# EAGLE design adum (EAGLE 7.2.0)
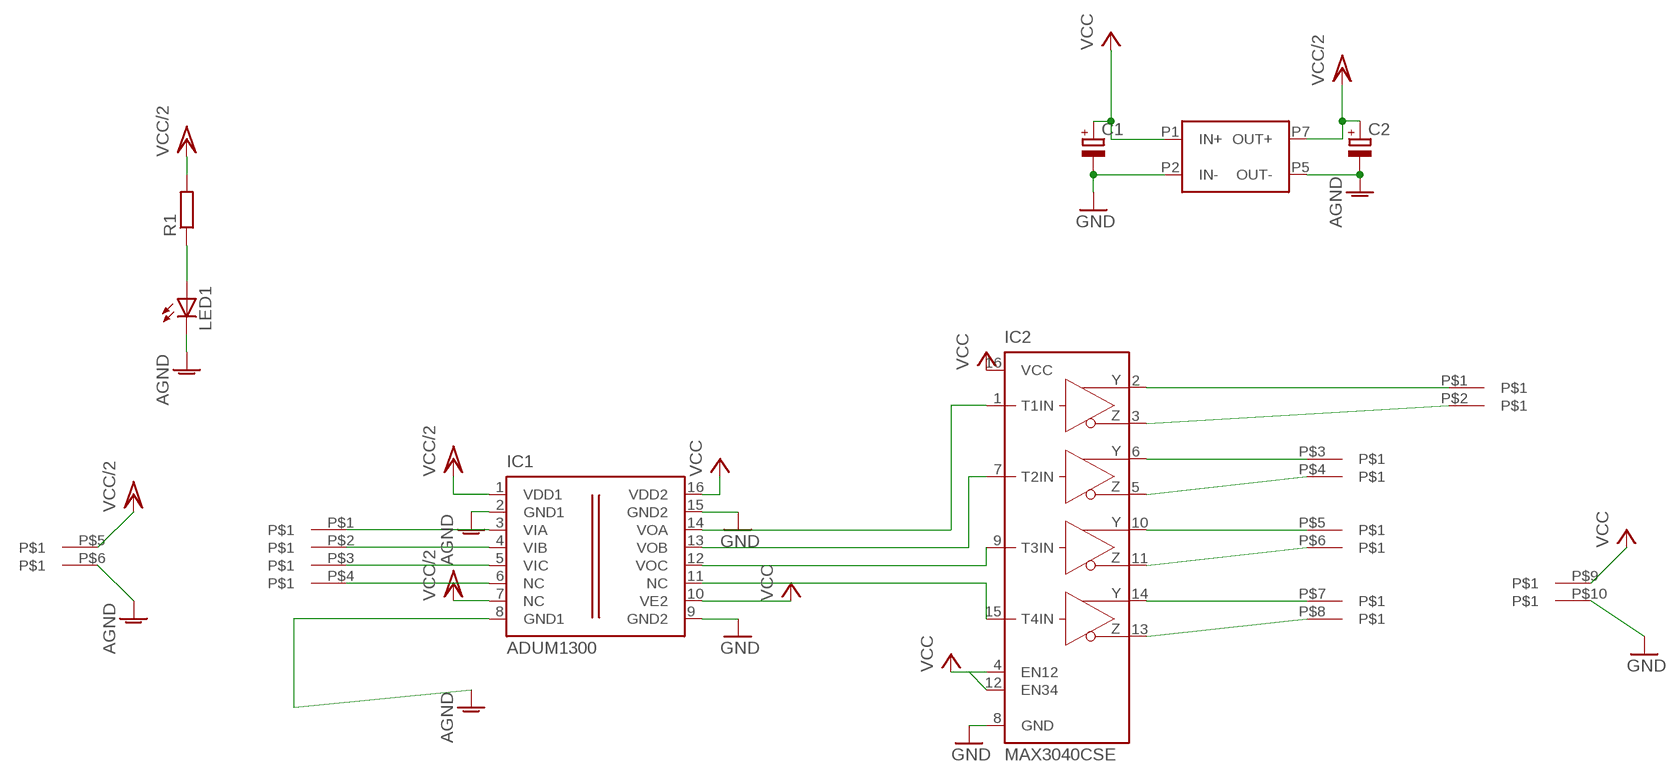
[diagram p0: schematic, sheet 1]

## Parts
C1  CPOL-EUSMCD  [SMC_D]
C2  CPOL-EUSMCD  [SMC_D]
IC1  ADUM1300  [SO-16W]
IC2  MAX3040CSE  [SO16]
LED1  LEDCHIP-LED0805  [CHIP-LED0805]
R1  R-EU_M0805  [M0805]
U$1  2X5  [2X5]
U$2  2X3  [2X3]
U$3  DCDC  [PWR]

## Nets
AGND: C2.- IC1.2(GND1) IC1.8(GND1) LED1.C U$2.P$6 U$3.P5(OUT-)
GND: C1.- IC1.9(GND2) IC1.15(GND2) IC2.8(GND) U$1.P$10 U$3.P2(IN-)
N$1: IC1.14(VOA) IC2.1(T1IN)
N$2: IC1.13(VOB) IC2.7(T2IN)
N$3: IC1.12(VOC) IC2.9(T3IN)
N$4: IC1.11(NC) IC2.15(T4IN)
N$5: IC2.3(Z1) U$1.P$2
N$6: IC2.2(Y1) U$1.P$1
N$7: IC2.11(Z3) U$1.P$6
N$8: IC1.6(NC) U$2.P$4
N$9: IC1.5(VIC) U$2.P$3
N$10: IC2.10(Y3) U$1.P$5
N$11: IC1.4(VIB) U$2.P$2
N$12: IC2.14(Y4) U$1.P$7
N$14: IC2.6(Y2) U$1.P$3
N$15: IC1.3(VIA) U$2.P$1
N$16: IC2.5(Z2) U$1.P$4
N$17: LED1.A R1.1
N$21: IC2.13(Z4) U$1.P$8
VCC: C1.+ IC1.10(VE2) IC1.16(VDD2) IC2.4(EN12) IC2.12(EN34) IC2.16(VCC) U$1.P$9 U$3.P1(IN+)
VCC/2: C2.+ IC1.1(VDD1) IC1.7(NC) R1.2 U$2.P$5 U$3.P7(OUT+)

## Library data of the parts
C1 C2 = resistor:CPOL-EU: POLARIZED CAPACITOR, European symbol
IC1 = analog-devices:ADUM1300: Triple-Channel Digital Isolators Source: http://www.analog.com/static/imported-files/data_sheets/ADuM1300_1301.pdf; MPN: ADUM1300ARWZ; OC_FARNELL: 1465621; OC_NEWARK: 19M8751
IC2 = maxim:MAX30*: ±10kV ESD-Protected, Quad 5V RS-485/RS-422 Transmitters Source: www.maxim-ic.com .. MAX3040-MAX3045.pdf; MF: MAXIM; MPN: MAX3040CSE+; OC_FARNELL: unknown; OC_NEWARK: 53K6603
LED1 = led:LED: LED OSRAM: - CHIPLED LG R971, LG N971, LY N971, LG Q971, LY Q971, LO R971, LY R971 LH N974, LH R974 LS Q976, LO Q976, LY Q976 LO Q996 - Hyper CHIPLED LW Q18S LB Q993, LB Q99A, LB R99A - SideLED LS A670, LO A670, LY A670, LG A670, LP A670 LB A673, LV A673, LT A673, LW A673 LH A674 LY A675 LS A676, LA A676, LO A676, LY A676, LW A676 LS A679, LY A679, LG A679 - Hyper Micro SIDELED® LS Y876, LA Y876, LO Y876, LY Y876 LT Y87S - SmartLED LW L88C, LW L88S LB L89C, LB L89S, LG L890 LS L89K, LO L89K, LY L89K LS L896, LA L896, LO L896, LY L896 - TOPLED LS T670, LO T670, LY T670, LG T670, LP T670 LSG T670, LSP T670, LSY T670, LOP T670, LYG T670 LG T671, LOG T671, LSG T671 LB T673, LV T673, LT T673, LW T673 LH T674 LS T676, LA T676, LO T676, LY T676, LB T676, LH T676, LSB T676, LW T676 LB T67C, LV T67C, LT T67C, LS T67K, LO T67K, LY T67K, LW E67C LS E67B, LA E67B, LO E67B, LY E67B, LB E67C, LV E67C, LT E67C LW T67C LS T679, LY T679, LG T679 LS T770, LO T770, LY T770, LG T770, LP T770 LB T773, LV T773, LT T773, LW T773 LH T774 LS E675, LA E675, LY E675, LS T675 LS T776, LA T776, LO T776, LY T776, LB T776 LHGB T686 LT T68C, LB T68C - Hyper Mini TOPLED® LB M676 - Mini TOPLED Santana® LG M470 LS M47K, LO M47K, LY M47K Source: http://www.osram.convergy.de LUXEON: - LUMILED® LXK2-PW12-R00, LXK2-PW12-S00, LXK2-PW14-U00, LXK2-PW14-V00 LXK2-PM12-R00, LXK2-PM12-S00, LXK2-PM14-U00 LXK2-PE12-Q00, LXK2-PE12-R00, LXK2-PE12-S00, LXK2-PE14-T00, LXK2-PE14-U00 LXK2-PB12-K00, LXK2-PB12-L00, LXK2-PB12-M00, LXK2-PB14-N00, LXK2-PB14-P00, LXK2-PB14-Q00 LXK2-PR12-L00, LXK2-PR12-M00, LXK2-PR14-Q00, LXK2-PR14-R00 LXK2-PD12-Q00, LXK2-PD12-R00, LXK2-PD12-S00 LXK2-PH12-R00, LXK2-PH12-S00 LXK2-PL12-P00, LXK2-PL12-Q00, LXK2-PL12-R00 Source: www.luxeon.com KINGBRIGHT: KA-3528ASYC Source: www.kingbright.com
R1 = rcl:R-EU_: RESISTOR, European symbol
U$1 = connectors:2X5
U$2 = connectors:2X3
U$3 = connectors:DCDC

## Board
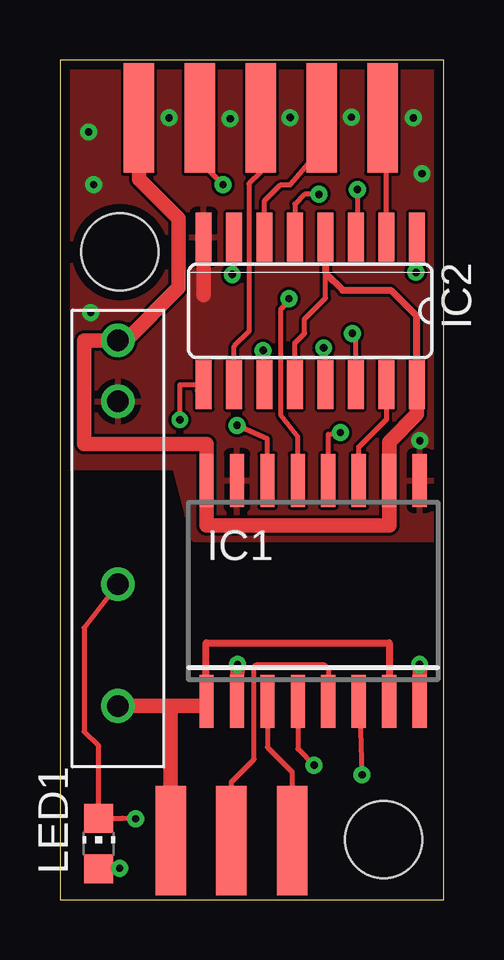
[diagram p1: board, top side]
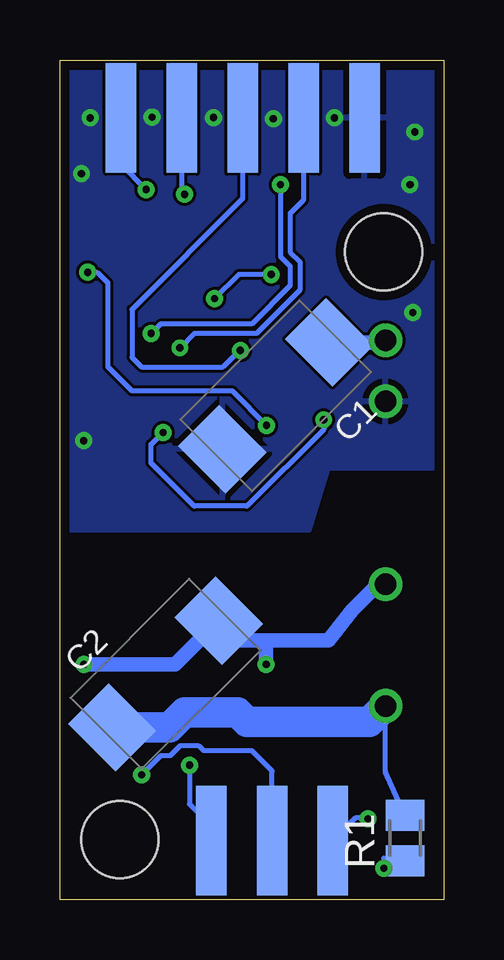
[diagram p2: board, bottom side, seen from below]

Size 16 x 35 mm. Coordinates in mm from the lower left corner, seen from the top.
Outline: 0,0 16,0 16,35 0,35 0,0
Copper layers (1*16): Top 0.035mm / dielectric 1.5mm / Bottom 0.035mm
Design rules "default *": minimum track width 0.2mm, minimum drill 0.3mm, track to track 0.125mm, track to pad 0.125mm, pad to pad 0.2mm, via to via 0.2mm, smd to smd 0mil, copper to edge 0.4mm, drill to drill 8mil, minimum pad ring 10mil, minimum via ring 8mil, stop-mask expansion 4mil, vias tented up to drill 0.5mm, thermal gap 10mil
Holes 3.2 mm at 2.5,27 13.5,2.5

### Footprints (pad centres in the part's own frame; a part is rotated, then mirrored left to right if it is on the bottom)
SMC_D = smd 2.4 x 2.8: + -3.15,0; - 3.15,0
SO-16W = smd 0.6 x 2.2: 1 -4.445,-4.6; 2 -3.175,-4.6; 3 -1.905,-4.6; 4 -0.635,-4.6; 5 0.635,-4.6; 6 1.905,-4.6; 7 3.175,-4.6; 8 4.445,-4.6; 9 4.445,4.6; 10 3.175,4.6; 11 1.905,4.6; 12 0.635,4.6; 13 -0.635,4.6; 14 -1.905,4.6; 15 -3.175,4.6; 16 -4.445,4.6
SO16 = smd 0.66 x 2.032: 1 -4.445,-3.073; 2 -3.175,-3.073; 3 -1.905,-3.073; 4 -0.635,-3.073; 5 0.635,-3.073; 6 1.905,-3.073; 7 3.175,-3.073; 8 4.445,-3.073; 9 4.445,3.073; 10 3.175,3.073; 11 1.905,3.073; 12 0.635,3.073; 13 -0.635,3.073; 14 -1.905,3.073; 15 -3.175,3.073; 16 -4.445,3.073
CHIP-LED0805 = smd 1.2 x 1.2: A 0,-1.05; C 0,1.05
M0805 = smd 1.3 x 1.6: 1 -0.95,0; 2 0.95,0
2X5 = smd 1.27 x 4.572: P$1 -5.08,0; P$3 -2.54,0; P$5 0,0; P$7 2.54,0; P$9 5.08,0 | smd 1.27 x 4.572 bottom: P$2 -5.08,0; P$4 -2.54,0; P$6 0,0; P$8 2.54,0; P$10 5.08,0
2X3 = smd 1.27 x 4.572: P$1 -2.54,0; P$3 0,0; P$5 2.54,0 | smd 1.27 x 4.572 bottom: P$2 -2.54,0; P$4 0,0; P$6 2.54,0
PWR = drill 0.9: P1 -7.62,0; P2 -5.08,0; P5 2.54,0; P7 7.62,0

### Placement (x,y rotation side)
C1  7,21 225 bottom
C2  11.6,9.4 45 bottom
IC1  10.56,12.87 0 top
IC2  10.44,24.54 180 top
LED1  1.62,2.33 0 top
R1  1.6,2.56 90 bottom
U$1  8.38,32.59 180 top
U$2  7.16,2.46 180 top
U$3  2.42,15.69 270 top

### Tracks (layer width: path | path; a pad name or v marks a point on that pad's centre or on a via)
AGND  (via drill 0.3)
  Top 0.2: v3.16,3.37 2.6,3.4 2.58,3.38 LED1.C 1.62,6.4 1,7 1,11.33 U$3.P5
  Top 0.6: IC1.8 v15.01,9.79 v15,9.8 | IC1.2 7.38,8.98 v7.4,9.8
  Bottom 0.2: v3.16,3.37 3.22,3.4 3.68,3.4 U$2.P$6
  Bottom 0.6: 7.4,10.8 4.8,10.8 3.8,12.06 2.72,13.15 U$3.P5 | v7.4,9.8 7.4,10.8 | 7.4,10.8 8.54,10.8 C2.- 11.2,9.8 v15,9.8
GND  (via drill 0.3)
  Top 0.6: IC1.9 15.01,17.4 | IC2.8 6,25.2
  other vias: 15.01,19.13 1.4,29.8 1.2,32 4.55,32.59 9.6,32.6 7.1,32.56 12.16,32.61 14.74,32.59 15.1,30.26 1.28,24.47
  pour Top: 0,35 16,35 16,15 5.6,15 4.8,18 0,18
  pour Bottom: 0,35 16,35 16,15.4 5.6,15.4 4.8,18 0,18
N$1  (via drill 0.3)
  Top 0.2: IC2.1 14.88,26.18 v14.85,26.15 | IC1.14 8.65,19.2 v7.38,19.77
  Bottom 0.2: v14.85,26.15 14.45,26.15 14,25.7 14,22.2 13,21.2 8.81,21.2 v7.38,19.77
N$2  (via drill 0.3)
  Top 0.2: v9.55,25.05 9.55,24.95 9.2,24.6 9.2,20.2 9.93,19.27 IC1.13 | IC2.7 7.26,26.14 v7.19,26.06
  Bottom 0.2: v7.19,26.06 8.54,26.06 v9.55,25.05
N$3  (via drill 0.3)
  Top 0.2: IC1.12 11.2,19.39 v11.7,19.47 | 5.73,21.2 IC2.9 5,21.47 v5,20
  Bottom 0.2: v5,20 5,19.6 8.2,16.4 10.4,16.4 12.2,18.2 12.2,18.97 v11.7,19.47
N$4
  Top 0.2: IC2.15 13.62,20.02 12.46,18.86 IC1.11
N$5  (via drill 0.3)
  Top 0.2: 12.35,28.55 IC2.3 12.4,27.67 v12.4,29.6
  Bottom 0.2: U$1.P$2 13.46,30.66 v12.4,29.6
N$6
  Top 0.2: IC2.2 13.62,32.43 U$1.P$1
N$7  (via drill 0.3)
  Top 0.2: IC2.11 8.6,21.53 v8.48,22.89
  Bottom 0.2: U$1.P$6 8.38,29.22 13,24.6 13,22.6 12.6,22.2 9.2,22.2 8.6,22.8 v8.48,22.89
N$8  (via drill 0.3)
  Top 0.2: IC1.6 12.46,8.94 v12.6,5.2
  Bottom 0.2: U$2.P$4 7.16,5.36 8,6.2 10,6.2 10.2,6.4 11,6.4 11.4,6 11.8,6 v12.6,5.2
N$9
  Top 0.2: 11,8.8 11.2,8.61 IC1.5 11.2,9.61 11,9.8 8.2,9.8 8.1,9.7 8.1,5.85 7.16,4.91 U$2.P$3
N$10
  Top 0.2: U$1.P$5 8.38,30.33 7.88,29.83 7.88,23.68 7.26,23.07 IC2.10
N$11  (via drill 0.3)
  Top 0.2: IC1.4 9.93,6.28 v10.6,5.6
  Bottom 0.2: v10.6,5.6 10.6,3.98 9.7,3.08 U$2.P$2
N$12  (via drill 0.3)
  Top 0.2: IC2.14 12.35,23.45 v12.2,23.6 | U$1.P$7 5.84,30.76 v6.8,29.8
  Bottom 0.2: v6.8,29.8 6.8,26.8 6.4,26.4 6.4,25.6 8,24 11.8,24 v12.2,23.6
N$14
  Top 0.2: IC2.6 8.54,29.14 9.2,29.8 9.6,29.8 10.72,31.12 U$1.P$3
N$15
  Top 0.2: IC1.3 8.65,6.34 9.7,5.3 U$2.P$1
N$16  (via drill 0.3)
  Top 0.2: IC2.5 9.8,28.41 9.8,29 10.2,29.4 v10.8,29.4
  Bottom 0.2: U$1.P$4 10.92,29.52 v10.8,29.4
N$17  (via drill 0.3)
  Top 0.2: v2.49,1.31 1.6,1.28 LED1.A
  Bottom 0.2: R1.1 2.49,1.72 v2.49,1.31
N$21  (via drill 0.3)
  Top 0.2: IC2.13 11.07,22.93 v11,23
  Bottom 0.2: U$1.P$8 5.84,29.16 6.4,28.6 6.4,27 6,26.6 6,25.4 7.8,23.6 10.4,23.6 v11,23
VCC
  Top 0.2: IC2.12 9.8,23.2 10.2,23.6 10.2,24.2 11.07,25.07 11.07,26.2
  Top 0.3: IC2.4 11.07,26.2 11.07,26.12 11.8,25.4 13.8,25.4 14.88,24.32 IC2.16
  Top 0.6: U$1.P$9 3.3,30.04 4.95,28.39 4.95,25.51 2.75,23.31 U$3.P1 1,23.31 1,19 6.12,19 IC1.16 6.12,15.6 13.73,15.6 IC1.10 13.73,19.08 14.88,20.23 IC2.16
  Bottom 0.6: C1.+ 2.5,23.23 U$3.P1
VCC/2
  Top 0.2: IC1.1 6.1,8.25 6.1,8
  Top 0.3: IC1.1 6.1,7.46 | 6.1,8 6.1,10.7 13.73,10.7 IC1.7
  Top 0.6: U$2.P$5 4.62,8.07 U$3.P7 6.03,8.07 6.1,8
  Bottom 0.2: R1.2 2.42,5.33 U$3.P7
  Bottom 1.27: C2.+ 11.43,7.17 10.8,7.8 8.6,7.8 8.2,7.4 3.09,7.4 U$3.P7